# Altium schematic sheet Sheet1.SchDoc
size 300 x 299 mm; SheetNumber: 1; SheetTotal: 1
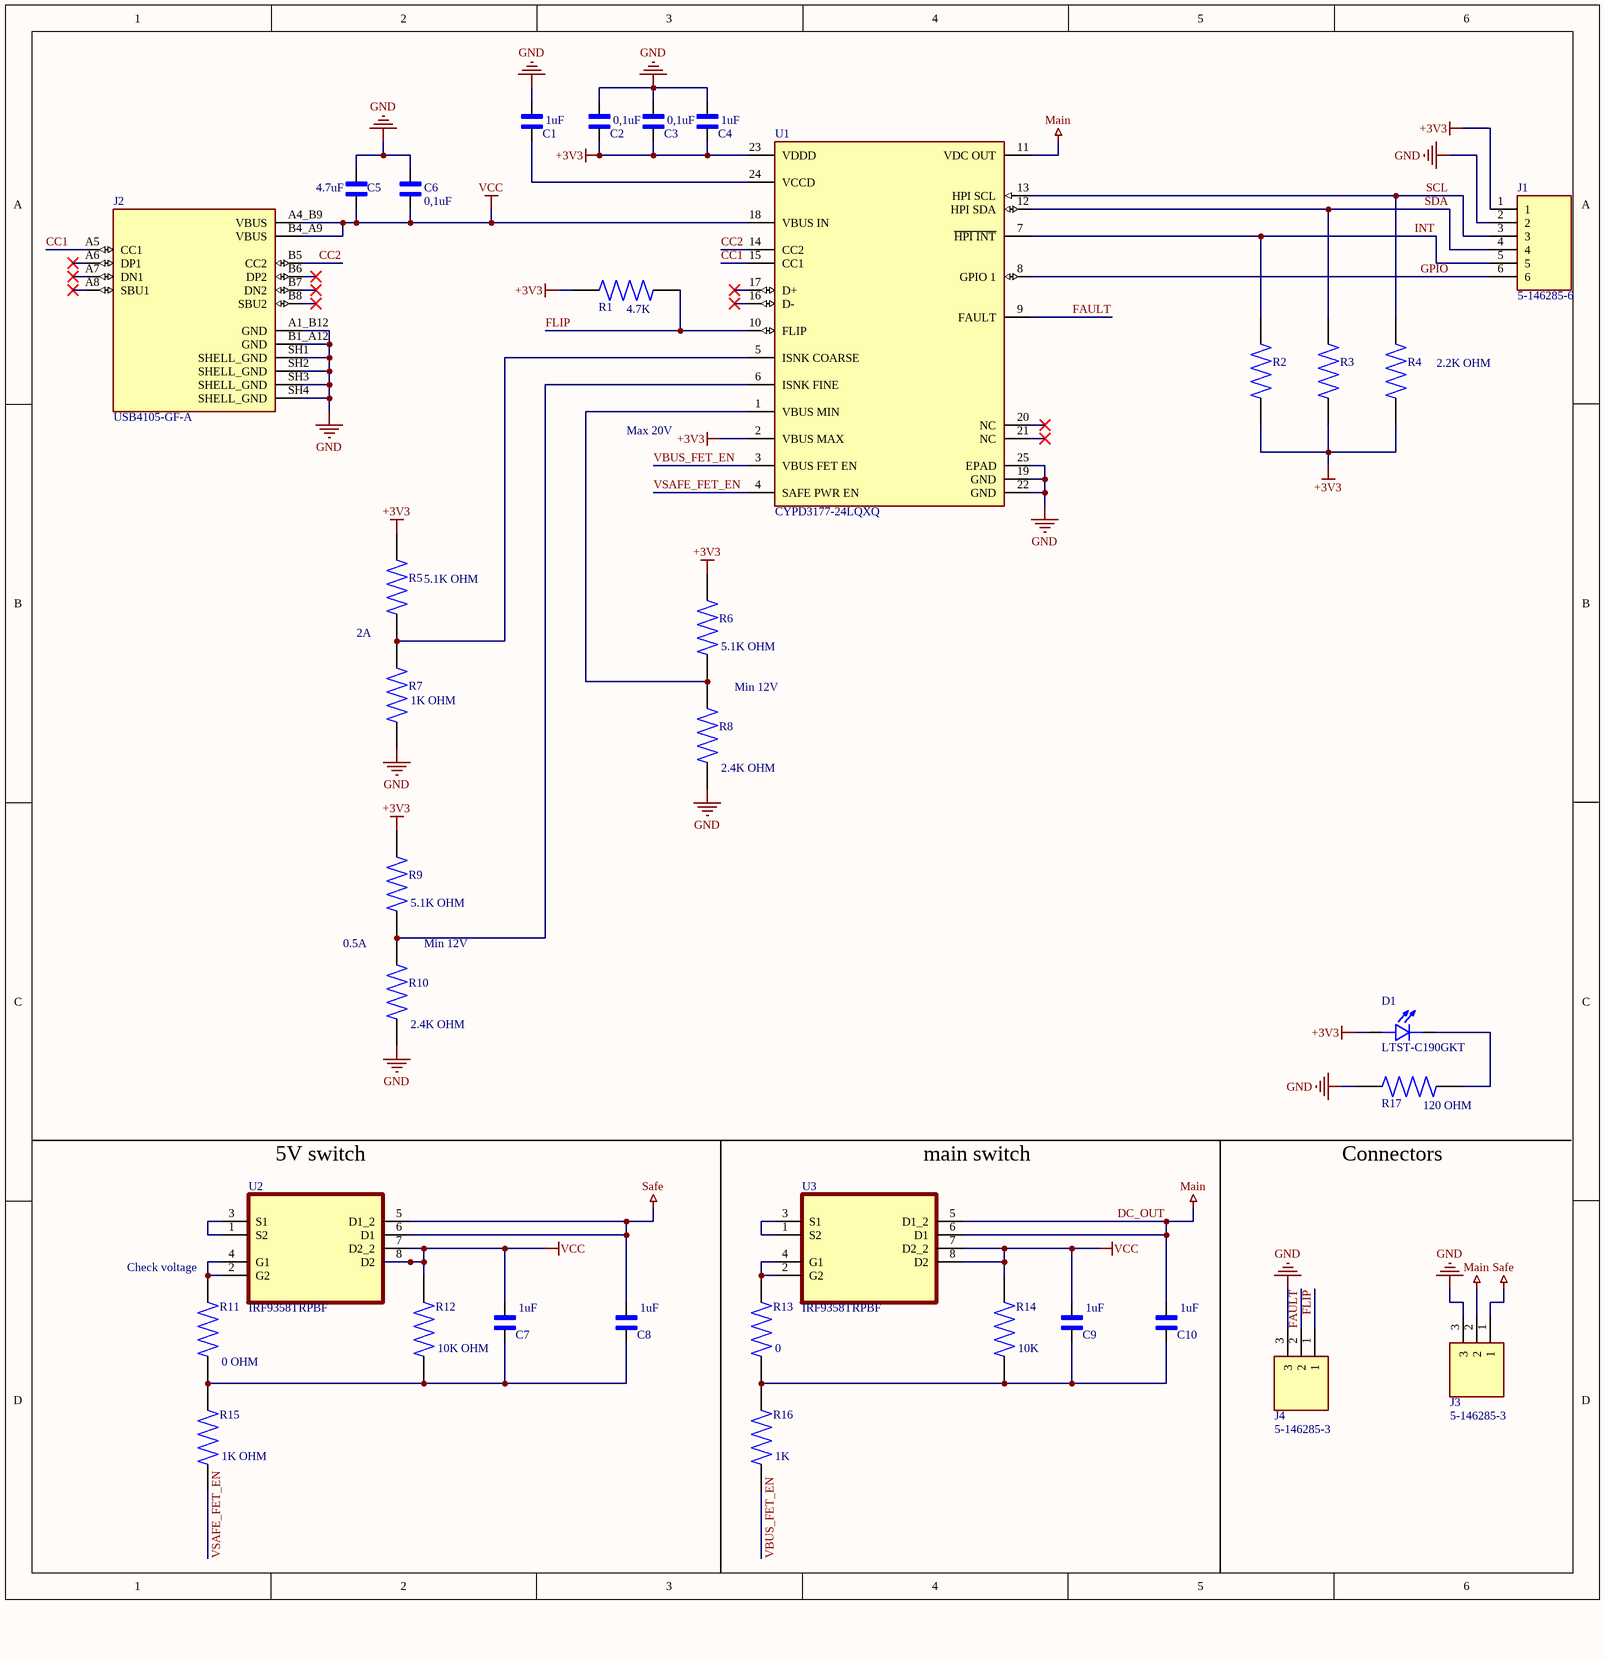
[diagram p0: Sheet1.SchDoc]

## Parts
C1  CL10A105KB8NNNC  [CAPC1608X94N]  (value not drawn)
C2  CL10B104KO8NNNC  [CAPC1608X94N]  (value not drawn)
C3  CL10B104KO8NNNC  [CAPC1608X94N]  (value not drawn)
C4  CL10A105KB8NNNC  [CAPC1608X94N]  (value not drawn)
C5  CL21A475KBQNNNE  [CAPC2012X140N]  (value not drawn)
C6  CL10B104KO8NNNC  [CAPC1608X94N]  (value not drawn)
C7  CL10A105KB8NNNC  [CAPC1608X94N]  (value not drawn)
C8  CL10A105KB8NNNC  [CAPC1608X94N]  (value not drawn)
C9  CL10A105KB8NNNC  [CAPC1608X94N]  (value not drawn)
C10  CL10A105KB8NNNC  [CAPC1608X94N]  (value not drawn)
D1  LTST-C190GKT  [LEDC1608X35N]
J1  5-146285-6  [TE_5-146285-6]
J2  USB4105-GF-A  [GCT_USB4105-GF-A]
J3  5-146285-3  [TE_5-146285-3]
J4  5-146285-3  [TE_5-146285-3]
R1  RC0603JR-074K7L  [RESC1607X60N]  (value not drawn)
R2  RC0603JR-072K2L  [RESC1607X60N]  (value not drawn)
R3  RC0603JR-072K2L  [RESC1607X60N]  (value not drawn)
R4  RC0603JR-072K2L  [RESC1607X60N]  (value not drawn)
R5  RC0603FR-075K1L  [RESC1607X60N]  (value not drawn)
R6  RC0603FR-075K1L  [RESC1607X60N]  (value not drawn)
R7  ERJ-3EKF1001V  [RESC1607X60N]  (value not drawn)
R8  RC0603FR-072K4L  [RESC1607X60N]  (value not drawn)
R9  RC0603FR-075K1L  [RESC1607X60N]  (value not drawn)
R10  RC0603FR-072K4L  [RESC1607X60N]  (value not drawn)
R11  ERJ-3GEY0R00V  [RES_ERJ-3GEY0R00V]  (value not drawn)
R12  RC0603FR-0710KL  [RESC1607X60N]  (value not drawn)
R13  ERJ-3GEY0R00V  [RES_ERJ-3GEY0R00V]  (value not drawn)
R14  RC0603FR-0710KL  [RESC1607X60N]  (value not drawn)
R15  ERJ-3EKF1001V  [RES_ERJ3EKF1001V]  (value not drawn)
R16  ERJ-3EKF1001V  [RES_ERJ3EKF1001V]  (value not drawn)
R17  RC0603FR-07120RL  [RESC1607X60N]  (value not drawn)
U1  CYPD3177-24LQXQ  [FP-002-16934-IPC_C]
U2  IRF9358TRPBF  [SOIC127P600X175-8N]
U3  IRF9358TRPBF  [SOIC127P600X175-8N]

## Nets
+3V3: C2.1 C3.1 C4.1 D1.A J1.1 R1.2 R2.2 R3.2 R4.2 R5.1 R6.1 R9.1 U1.2(VBUS_MAX) U1.23(VDDD)
DC_OUT: C10.2 J3.2 U1.11(VDC_OUT) U3.5(D1_2) U3.6(D1)  [also labelled Main]
GND: C1.2 C2.2 C3.2 C4.2 C5.1 C6.2 J1.2 J2.A1_B12(GND) J2.B1_A12(GND) J2.SH1(SHELL_GND) J2.SH2(SHELL_GND) J2.SH3(SHELL_GND) J2.SH4(SHELL_GND) J3.3 J4.3 R7.2 R8.2 R10.2 R17.1 U1.19(GND) U1.22(GND) U1.25(EPAD)
Safe: C8.2 J3.1 U2.5(D1_2) U2.6(D1)
VCC: C5.2 C6.1 C7.2 C9.2 J2.A4_B9(VBUS) J2.B4_A9(VBUS) R12.2 R14.2 U1.18(VBUS_IN) U2.7(D2_2) U2.8(D2) U3.7(D2_2) U3.8(D2)
CC1: J2.A5(CC1) U1.15(CC1)
CC2: J2.B5(CC2) U1.14(CC2)
FAULT: J4.2 U1.9(FAULT)
FLIP: J4.1 R1.1 U1.10(FLIP)
GPIO: J1.6 U1.8(GPIO_1)
INT: J1.5 R2.1 U1.7(~{HPI_INT})
SCL: J1.3 R4.1 U1.13(HPI_SCL)
SDA: J1.4 R3.1 U1.12(HPI_SDA)
VBUS_FET_EN: R16.1 U1.3(VBUS_FET_EN)
VSAFE_FET_EN: R15.1 U1.4(SAFE_PWR_EN)
NetC1_1: C1.1 U1.24(VCCD)
NetC7_1: C7.1 C8.1 R11.1 R12.1 R15.2
NetC9_1: C9.1 C10.1 R13.1 R14.1 R16.2
NetD1_C: D1.C R17.2
NetR5_2: R5.2 R7.1 U1.5(ISNK_COARSE)
NetR6_2: R6.2 R8.1 U1.1(VBUS_MIN)
NetR9_2: R9.2 R10.1 U1.6(ISNK_FINE)
NetR11_2: R11.2 U2.2(G2) U2.4(G1)
NetR13_2: R13.2 U3.2(G2) U3.4(G1)
NetU2_1: U2.1(S2) U2.3(S1)
NetU3_1: U3.1(S2) U3.3(S1)

Not connected (* = marked no-connect by the designer): J2 A6(DP1)* A7(DN1)* A8(SBU1)* B6(DP2)* B7(DN2)* B8(SBU2)*; U1 16(D-)* 17(D+)* 20(NC)* 21(NC)*

## Notes on the sheet
- (near C1) 1uF
- 0,1uF
- (near C4) 1uF
- (near C5) 4.7uF
- (near C6) 0,1uF
- (near R1) 4.7K
- (near R4) 2.2K OHM
- Max 20V
- (near R5) 5.1K OHM
- 2A
- (near R6) 5.1K OHM
- (near R7) 1K OHM
- Min 12V
- (near R8) 2.4K OHM
- 0.5A
- (near R9) 5.1K OHM
- (near R10) 2.4K OHM
- (near R17) 120 OHM
- 5V switch
- main switch
- Connectors
- Check voltage
- (near R12) 10K OHM
- (near C7) 1uF
- (near C8) 1uF
- (near R13) 0
- (near R14) 10K
- (near C9) 1uF
- (near C10) 1uF
- (near R11) 0 OHM
- (near R15) 1K OHM
- (near R16) 1K

## Library data of the parts
C1 C4 C7-C10 = 06035C105KAT2A: CAP CER 1UF 50V X5R 0603; MF: {'manufacturer': u'KYOCERA AVX Components Corporation'}; Package: None; Price: None; Value: *; MP: 06035C105KAT2A; Availability: Unavailable
C2 C3 C6 = 06035C105KAT2A: CAP CER 0.1UF 16V X7R 0603; MF: {'manufacturer': u'KYOCERA AVX Components Corporation'}; Package: None; Price: None; Value: *; MP: 06035C105KAT2A; Availability: Unavailable
C5 = CL21A475KBQNNNE: Cap Ceramic 4.7uF 50V X5R 10% SMD 0805 85Â°C Embossed Plastic T/R; MF: {'manufacturer': u'Samsung Electro-Mechanics'}; Package: None; Price: None; Value: *; MP: CL21A475KBQNNNE; Availability: Unavailable
D1 = LTST-C190GKT: LED; SMD; 0603; Green; 18-180mcd; 1.6x0.8x0.8mm; 130Â°; 1.6Ã·2.4V; 20mA <a href="https://pricing.snapeda.com/parts/LTST-C190GKT/Lite-On%20Inc./view-part?ref=eda">Check availability</a>; MF: {'manufacturer': u'Lite-On Inc.'}; Package: None; Price: None; Value: *; MP: LTST-C190GKT; Availability: Unavailable
J1 = 5-146285-6: MF: {'manufacturer': u'TE Connectivity'}; Package: None; Price: None; Value: *; MP: 5-146285-6; Availability: Unavailable
J2 = USB4105-GF-A: MF: {'manufacturer': u'GCT'}; Package: None; Price: None; Value: *; MP: USB4105-GF-A; Availability: Unavailable
J3 J4 = 5-146285-3: MF: {'manufacturer': u'TE Connectivity'}; Package: None; Price: None; Value: *; MP: 5-146285-3; Availability: Unavailable
R1 = RC0603FR-0710KL: RES 4.7K OHM 5% 1/10W 0603; MF: {'manufacturer': u'Yageo'}; Package: None; Price: None; Value: *; MP: RC0603FR-0710KL; Availability: Unavailable
R2-R4 = RC0603FR-0710KL: RES 2.2K OHM 5% 1/10W 0603; MF: {'manufacturer': u'Yageo'}; Package: None; Price: None; Value: *; MP: RC0603FR-0710KL; Availability: Unavailable
R5 R6 R9 = RC0603FR-0710KL: RES 5.1K OHM 1% 1/10W 0603; MF: {'manufacturer': u'Yageo'}; Package: None; Price: None; Value: *; MP: RC0603FR-0710KL; Availability: Unavailable
R7 = RC0603FR-0710KL: RES SMD 1K OHM 1% 1/10W 0603; MF: {'manufacturer': u'Yageo'}; Package: None; Price: None; Value: *; MP: RC0603FR-0710KL; Availability: Unavailable
R8 R10 = RC0603FR-0710KL: RES 2.4K OHM 1% 1/10W 0603; MF: {'manufacturer': u'Yageo'}; Package: None; Price: None; Value: *; MP: RC0603FR-0710KL; Availability: Unavailable
R11 R13 = ERJ-3GEY0R00V: <a href="https://pricing.snapeda.com/parts/ERJ-3GEY0R00V/Panasonic/view-part?ref=eda">Check availability</a>; MF: {'manufacturer': u'Panasonic'}; Package: None; Price: None; Value: *; MP: ERJ-3GEY0R00V; Availability: Unavailable
R12 R14 = RC0603FR-0710KL: RES 10K OHM 1% 1/10W 0603; MF: {'manufacturer': u'Yageo'}; Package: None; Price: None; Value: *; MP: RC0603FR-0710KL; Availability: Unavailable
R15 R16 = ERJ3EKF1001V: RES SMD 1K OHM 1% 1/10W 0603; MF: {'manufacturer': u'Panasonic'}; Package: None; Price: None; Value: *; MP: ERJ3EKF1001V; Availability: Unavailable
R17 = RC0603FR-0710KL: RES 120 OHM 1% 1/10W 0603; MF: {'manufacturer': u'Yageo'}; Package: None; Price: None; Value: *; MP: RC0603FR-0710KL; Availability: Unavailable
U1 = CMP-12917-000005-1: IC USB TYPE-C PORT CONTROL 24QFN
U2 U3 = IRF9358TRPBF: HEXFET Power MOSFET; MF: {'manufacturer': u'Infineon'}; Package: None; Price: None; Value: *; MP: IRF9358TRPBF; Availability: Unavailable